# Altium schematic sheet K22.SchDoc
size Letter; Organization: Altium Limited; Address1: L3, 12a Rodborough Rd; Address2: Frenchs Forest; Address3: NSW; Address4: Australia 2086
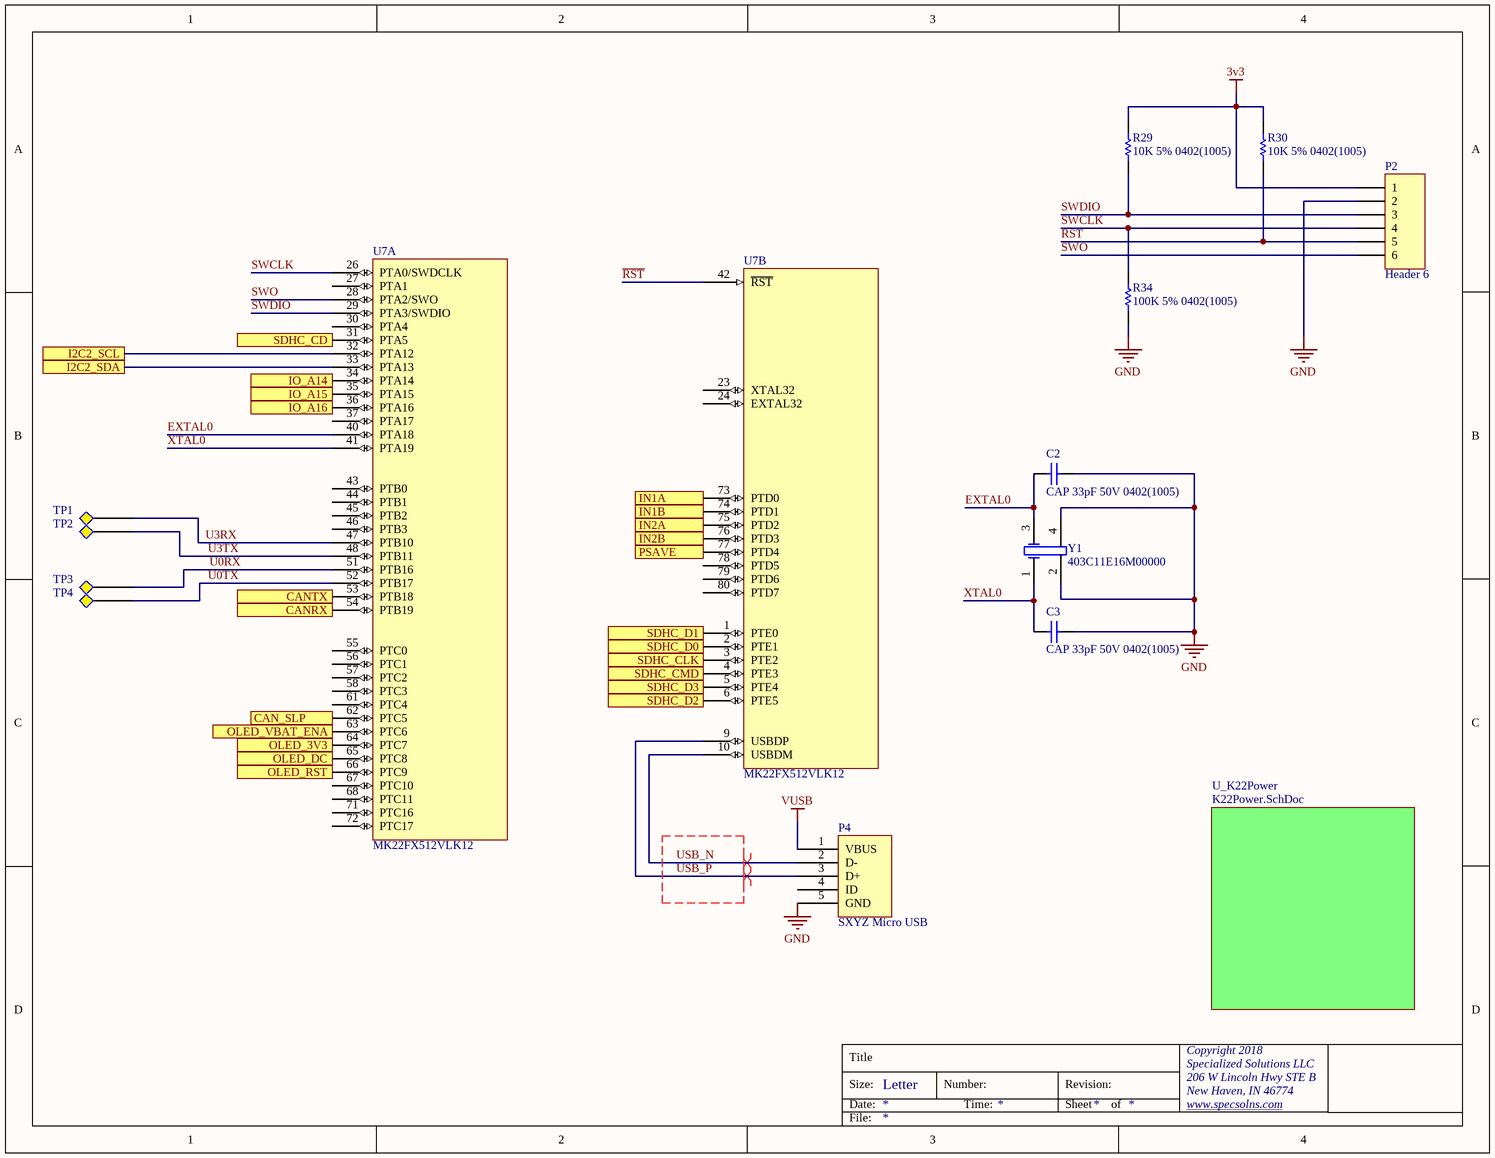
[diagram p0: K22.SchDoc]

## Parts
C2  CAP 33pF 50V 0402(1005)  [CAPC0402(1005)60_N]
C3  CAP 33pF 50V 0402(1005)  [CAPC0402(1005)60_N]
P2  Header 6  [HDR1X6]
P4  SXYZ Micro USB  [SXYZ Micro USB]
R29  10K 5% 0402(1005)  [RESC0402(1005)_N]
R30  10K 5% 0402(1005)  [RESC0402(1005)_N]
R34  100K 5% 0402(1005)  [RESC0402(1005)_L]
TP1  Test Point  [TP]  (value not drawn)  (no BOM)
TP2  Test Point  [TP]  (value not drawn)  (no BOM)
TP3  Test Point  [TP]  (value not drawn)  (no BOM)
TP4  Test Point  [TP]  (value not drawn)  (no BOM)
U7  MK22FX512VLK12  [TSQFP50P1400X1400X160-80N]  (parts A,B of 3)
Y1  403C11E16M00000  [DFN155P250X80-4N]

## Sub-sheets
U_K22Power = K22Power.SchDoc: no entries

## Ports
CAN_SLP, CANRX, CANTX, I2C2_SCL, I2C2_SDA, IN1A, IN1B, IN2A, IN2B, IO_A14, IO_A15, IO_A16, OLED_3V3, OLED_DC, OLED_RST, OLED_VBAT_ENA, PSAVE, SDHC_CD, SDHC_CLK, SDHC_CMD, SDHC_D0, SDHC_D1, SDHC_D2, SDHC_D3

## Nets
3v3: P2.1 R29.2 R30.2
GND: C2.2 C3.2 P2.2 P4.5(GND) R34.1 Y1.2(GND) Y1.4(GND)
VUSB: P4.1(VBUS)
~{RST}: P2.5 R30.1 U7.42(~{RST})
CAN_SLP: U7.62(PTC5) ; port CAN_SLP
CANRX: U7.54(PTB19) ; port CANRX
CANTX: U7.53(PTB18) ; port CANTX
EXTAL0: C2.1 U7.40(PTA18) Y1.3(OSC2)
I2C2_SCL: U7.32(PTA12) ; port I2C2_SCL
I2C2_SDA: U7.33(PTA13) ; port I2C2_SDA
IN1A: U7.73(PTD0) ; port IN1A
IN1B: U7.74(PTD1) ; port IN1B
IN2A: U7.75(PTD2) ; port IN2A
IN2B: U7.76(PTD3) ; port IN2B
IO_A14: U7.34(PTA14) ; port IO_A14
IO_A15: U7.35(PTA15) ; port IO_A15
IO_A16: U7.36(PTA16) ; port IO_A16
OLED_3V3: U7.64(PTC7) ; port OLED_3V3
OLED_DC: U7.65(PTC8) ; port OLED_DC
OLED_RST: U7.66(PTC9) ; port OLED_RST
OLED_VBAT_ENA: U7.63(PTC6) ; port OLED_VBAT_ENA
PSAVE: U7.77(PTD4) ; port PSAVE
SDHC_CD: U7.31(PTA5) ; port SDHC_CD
SDHC_CLK: U7.3(PTE2) ; port SDHC_CLK
SDHC_CMD: U7.4(PTE3) ; port SDHC_CMD
SDHC_D0: U7.2(PTE1) ; port SDHC_D0
SDHC_D1: U7.1(PTE0) ; port SDHC_D1
SDHC_D2: U7.6(PTE5) ; port SDHC_D2
SDHC_D3: U7.5(PTE4) ; port SDHC_D3
SWCLK: P2.4 R34.2 U7.26(PTA0/SWDCLK)
SWDIO: P2.3 R29.1 U7.29(PTA3/SWDIO)
SWO: P2.6 U7.28(PTA2/SWO)
U0RX: TP3.1 U7.51(PTB16)
U0TX: TP4.1 U7.52(PTB17)
U3RX: TP1.1 U7.47(PTB10)
U3TX: TP2.1 U7.48(PTB11)
USB_N: P4.2(D-) U7.10(USBDM)
USB_P: P4.3(D+) U7.9(USBDP)
XTAL0: C3.1 U7.41(PTA19) Y1.1(OSC1)

Not connected (* = marked no-connect by the designer): P4 4(ID); U7 23(XTAL32) 24(EXTAL32) 27(PTA1) 30(PTA4) 37(PTA17) 43(PTB0) 44(PTB1) 45(PTB2) 46(PTB3) 55(PTC0) 56(PTC1) 57(PTC2) 58(PTC3) 61(PTC4) 67(PTC10) 68(PTC11) 71(PTC16) 72(PTC17) 78(PTD5) 79(PTD6) 80(PTD7)

## Layout directives
differential pair: USB_N, USB_P

## Notes on the sheet
- Title
- Size:
- Date:
- Letter
- Number:
- Time:
- Revision:
- Sheet
- of
- Copyright 2018
- Specialized Solutions LLC
- 206 W Lincoln Hwy STE B
- New Haven, IN 46774
- www.specsolns.com <http://www.specsolns.com>
- File:

## Library data of the parts
C2 C3 = CMP-1034-01004-1: CAP 33pF 50V ±5% 0402 (1005 Metric) Thickness 0.6mm SMD; Tolerance: Â±5%; Case-Metric: 1005; Case-EIA: 0402; Rated Voltage: 50 V; Value: 33pF; Technology: SMT; Max Thickness: 0.6 mm
P2 = Header 6: Header, 6-Pin; LatestRevisionDate: 17-Jul-2002; LatestRevisionNote: Re-released for DXP Platform.; Publisher: Altium Limited
P4 = SXYZ MicroUSB: Micro USB Connector
R29 R30 = CMP-1011-00098-1: 10K 0.063W 5% 0402 (1005 Metric)  SMD; Case-Metric: 1005; Value: 10000.00 Ohm; Case-EIA: 0402; Technology: SMT; Tolerance: 5 %; Power: 0.063 W
R34 = CMP-1011-00122-1: 100K 0.063W 5% 0402 (1005 Metric)  SMD; Value: 100000.00 Ohm; Case-EIA: 0402; Case-Metric: 1005; Power: 0.063 W; Technology: SMT; Tolerance: 5 %
TP1-TP4 = TP
Y1 = 403C11E16M00000: CRYSTAL 16.0000MHZ 20PF SMD 3.20x2.50; Published: 8-Jun-2000; LatestRevisionDate: 17-Jul-2002; LatestRevisionNote: Re-released for DXP Platform.; PackageReference: R38; Publisher: Altium Limited; PackageDescription: Crystal, Thru-Hole; 2 Leads; Body 3.1 x 8.2 mm (Dia.xH)